# EAGLE board AIO (EAGLE 6.5.0), part 1 of 2
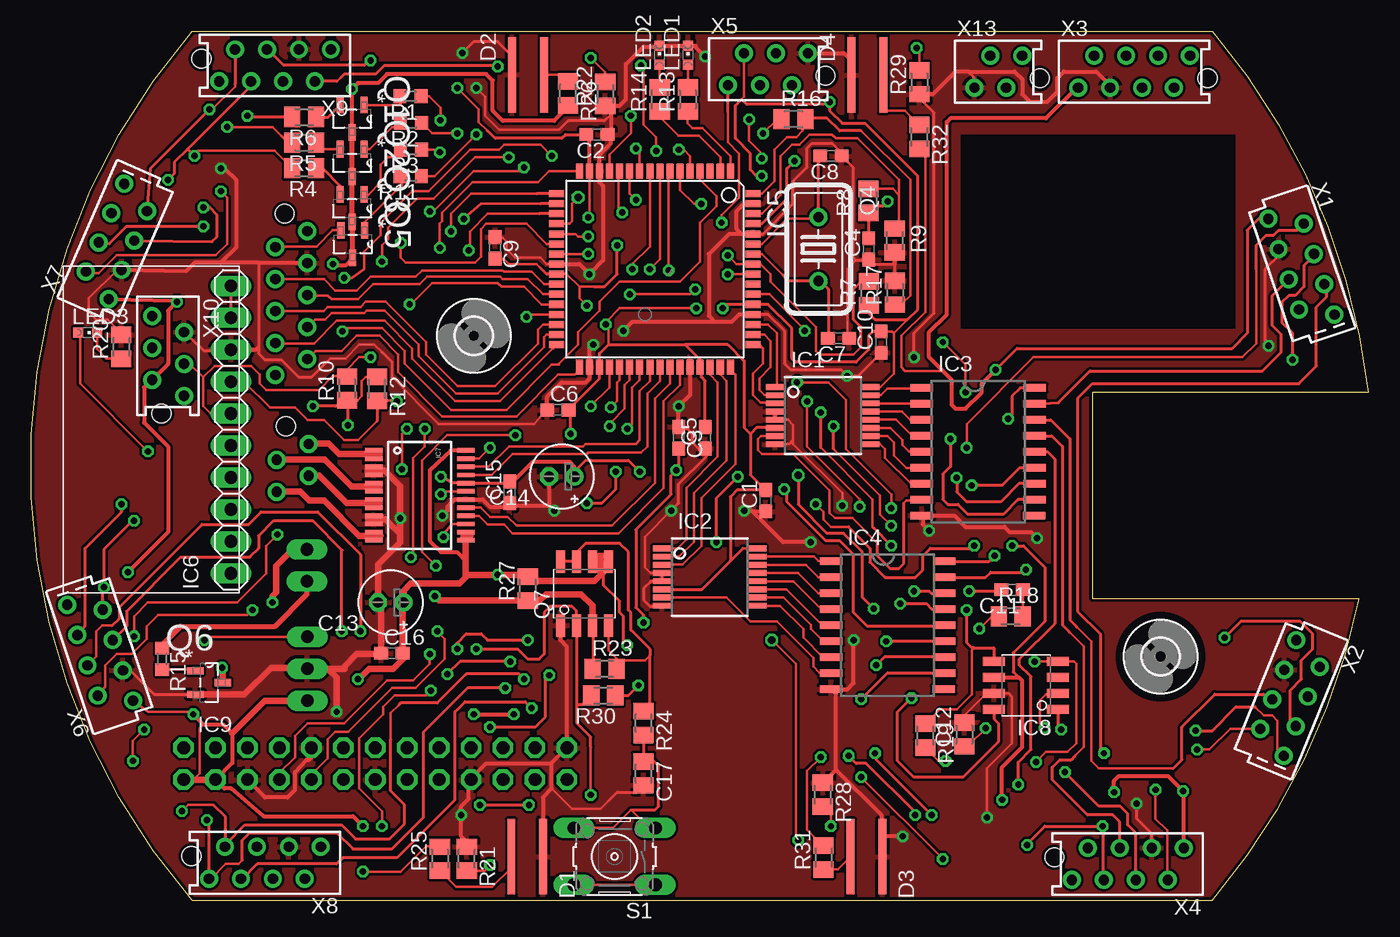
[diagram p2: board, top side]
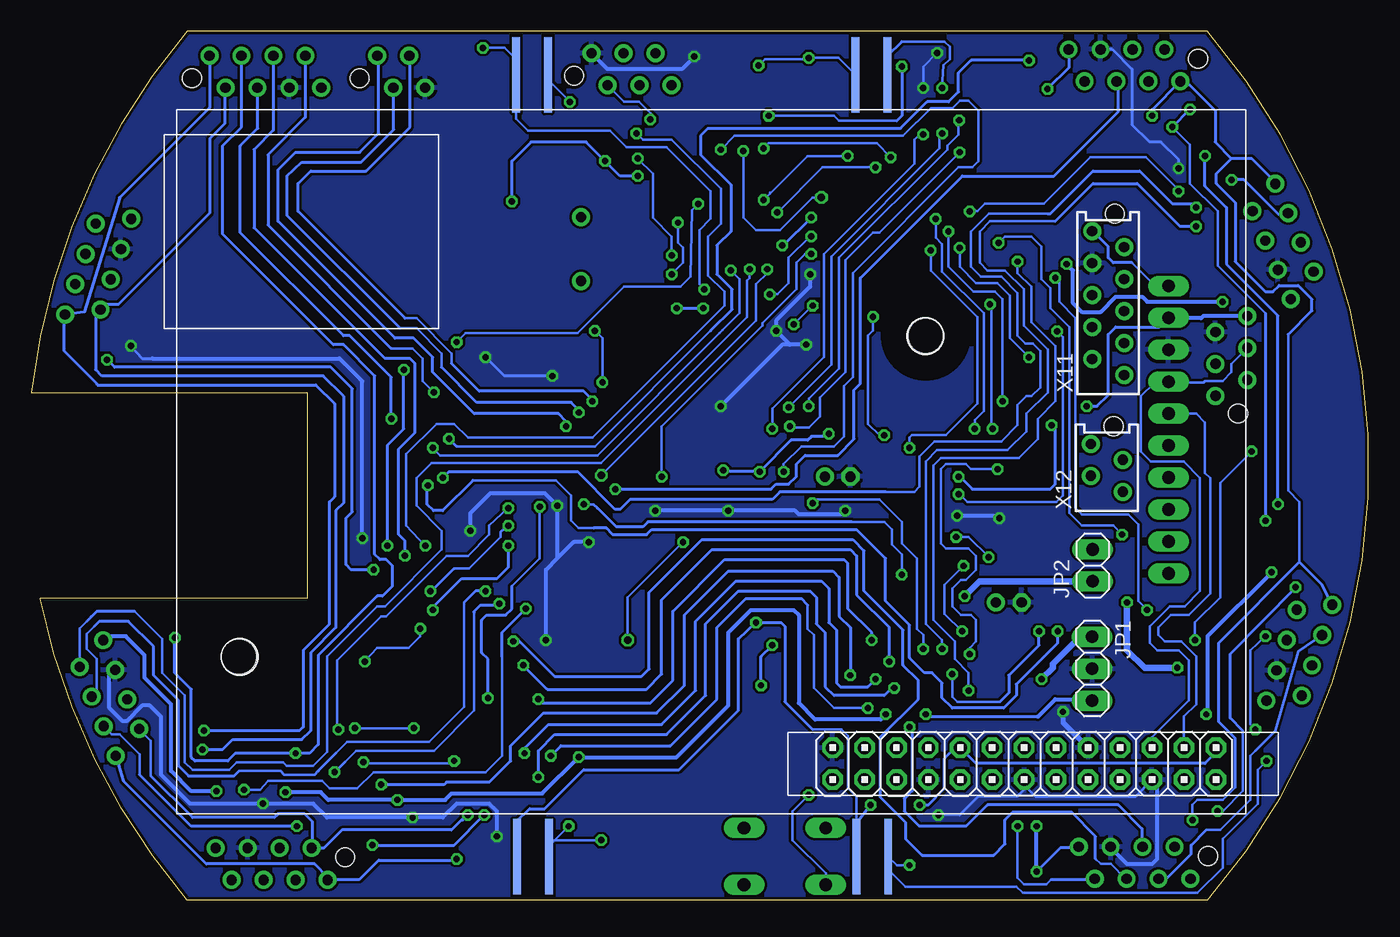
[diagram p3: board, bottom side, seen from below]

Size 106.26 x 69.1 mm. Coordinates in mm from the lower left corner, seen from the top.
Outline: 12.76,0 arc-81 12.76,69.1 93.86,69.1 arc-34 106.26,40.4 84.36,40.4 84.36,24 105.56,24 arc-29 93.86,0 12.76,0
Copper layers (1*16): Top 0.035mm / dielectric 1.5mm / Bottom 0.035mm
Design rules "production": minimum track width 8mil, minimum drill 14mil, track to track 8mil, track to pad 8mil, pad to pad 6mil, via to via 8mil, smd to smd 6mil, copper to edge 10mil, drill to drill 8mil, minimum pad ring 12mil, minimum via ring 8mil, stop-mask expansion 4mil, vias tented up to drill 25mil, thermal gap 10mil

## Footprints (pad centres in the part's own frame; a part is rotated, then mirrored left to right if it is on the bottom)
C0603 = smd 1.1 x 1: 1 -0.85,0; 2 0.85,0
M0805 = smd 1.3 x 1.6: 1 -0.95,0; 2 0.95,0
E2-5 = drill 0.813 pad 1.27: + -1.016,0 | drill 0.813 pad 1.27 octagon: - 1.016,0
CNY70 = smd 6 x 0.635: LED_A -3,1.27; LED_C -3,-1.27 | smd 6 x 0.635 bottom: TRANS_C -3,-1.27; TRANS_E -3,1.27
SSOP16 = smd 0.46 x 1.43: 1 -2.275,-3.795; 2 -1.625,-3.795; 3 -0.975,-3.795; 4 -0.325,-3.795; 5 0.325,-3.795; 6 0.975,-3.795; 7 1.625,-3.795; 8 2.275,-3.795; 9 2.275,3.795; 10 1.625,3.795; 11 0.975,3.795; 12 0.325,3.795; 13 -0.325,3.795; 14 -0.975,3.795; 15 -1.625,3.795; 16 -2.275,3.795
SOP18 = smd 0.6 x 1.8: 1 -5.08,-4.475; 2 -3.81,-4.475; 3 -2.54,-4.475; 4 -1.27,-4.475; 5 0,-4.475; 6 1.27,-4.475; 7 2.54,-4.475; 8 3.81,-4.475; 9 5.08,-4.475; 10 5.08,4.475; 11 3.81,4.5; 12 2.54,4.5; 13 1.27,4.5; 14 0,4.5; 15 -1.27,4.5; 16 -2.54,4.5; 17 -3.81,4.5; 18 -5.08,4.5
TQFP-64A-64 = smd 1.194 x 0.559: 1 -7.8,6; 2 -7.8,5.2; 3 -7.8,4.4; 4 -7.8,3.6; 5 -7.8,2.8; 6 -7.8,2; 7 -7.8,1.2; 8 -7.8,0.4; 9 -7.8,-0.4; 10 -7.8,-1.2; 11 -7.8,-2; 12 -7.8,-2.8; 13 -7.8,-3.6; 14 -7.8,-4.4; 15 -7.8,-5.2; 16 -7.8,-6; 33 7.8,-6; 34 7.8,-5.2; 35 7.8,-4.4; 36 7.8,-3.6; 37 7.8,-2.8; 38 7.8,-2; 39 7.8,-1.2; 40 7.8,-0.4; 41 7.8,0.4; 42 7.8,1.2; 43 7.8,2; 44 7.8,2.8; 45 7.8,3.6; 46 7.8,4.4; 47 7.8,5.2; 48 7.8,6 | smd 0.559 x 1.194: 17 -6,-7.8; 18 -5.2,-7.8; 19 -4.4,-7.8; 20 -3.6,-7.8; 21 -2.8,-7.8; 22 -2,-7.8; 23 -1.2,-7.8; 24 -0.4,-7.8; 25 0.4,-7.8; 26 1.2,-7.8; 27 2,-7.8; 28 2.8,-7.8; 29 3.6,-7.8; 30 4.4,-7.8; 31 5.2,-7.8; 32 6,-7.8; 49 6,7.8; 50 5.2,7.8; 51 4.4,7.8; 52 3.6,7.8; 53 2.8,7.8; 54 2,7.8; 55 1.2,7.8; 56 0.4,7.8; 57 -0.4,7.8; 58 -1.2,7.8; 59 -2,7.8; 60 -2.8,7.8; 61 -3.6,7.8; 62 -4.4,7.8; 63 -5.2,7.8; 64 -6,7.8
GY-81 = drill 1.016 long: 3V3 8.89,-6.35; A_INT1 -3.81,-6.35; G_INT -6.35,-6.35; GND 6.35,-6.35; M_DRDY -1.27,-6.35; P_E0C -11.43,-6.35; P_XCLR -8.89,-6.35; SCL 3.81,-6.35; SDA 1.27,-6.35; VCC_IN 11.43,-6.35
SSOP24 = smd 0.348 x 1.397: 1 -3.575,-3.656; 2 -2.925,-3.656; 3 -2.275,-3.656; 4 -1.625,-3.656; 5 -0.975,-3.656; 6 -0.325,-3.656; 7 0.325,-3.656; 8 0.975,-3.656; 9 1.625,-3.656; 10 2.275,-3.656; 11 2.925,-3.656; 12 3.575,-3.656; 13 3.575,3.656; 14 2.925,3.656; 15 2.275,3.656; 16 1.625,3.656; 17 0.975,3.656; 18 0.325,3.656; 19 -0.325,3.656; 20 -0.975,3.656; 21 -1.625,3.656; 22 -2.275,3.656; 23 -2.925,3.656; 24 -3.575,3.656
SO08 = smd 0.72 x 1.78: 1 -1.905,-2.543; 2 -0.635,-2.543; 3 0.635,-2.543; 4 1.905,-2.543; 5 1.905,2.543; 6 0.635,2.543; 7 -0.635,2.543; 8 -1.905,2.543
RASPERRRY-PI = drill 1.016 octagon: 3V3@1 50.736,82.608; 3V3@2 50.736,62.288; 5V@1 53.276,82.608; 5V@2 53.276,80.068; GND@1 50.736,72.448; GND@2 50.736,52.128; GND@3 53.276,77.528; GND@4 53.276,67.368; GND@5 53.276,59.748; GPIO_0 50.736,80.068; GPIO_1 50.736,77.528; GPIO_4 50.736,74.988; GPIO_7 53.276,52.128; GPIO_8 53.276,54.668; GPIO_9 50.736,57.208; GPIO_10 50.736,59.748; GPIO_11 50.736,54.668; GPIO_14 53.276,74.988; GPIO_15 53.276,72.448; GPIO_17 50.736,69.908; GPIO_18 53.276,69.908; GPIO_21 50.736,67.368; GPIO_22 50.736,64.828; GPIO_23 53.276,64.828; GPIO_24 53.276,62.288; GPIO_25 53.276,57.208
1X03 = drill 1.016 long: 1 -2.54,0; 2 0,0; 3 2.54,0
1X02 = drill 1.016 long: 1 -1.27,0; 2 1.27,0
CHIPLED_0603 = smd 0.8 x 0.8: A 0,-0.75; C 0,0.75
SOT95P240X112-3N = smd 1.321 x 0.559: D 1.092,0; G -1.092,0.94; S -1.092,-0.94
HC18U-V = drill 0.813: 1 -2.54,0; 2 2.54,0
R0603 = smd 1 x 1.1: 1 -0.85,0; 2 0.85,0
B3F-10XX = drill 1.016 long: 1 -3.251,2.261; 2 3.251,2.261; 3 -3.251,-2.261; 4 3.251,-2.261
2,8 = hole 2.8: 0,0
FSIDE-8 = drill 0.813: 1 -4.445,-1.27; 2 -3.175,1.27; 3 -1.905,-1.27; 4 -0.635,1.27; 5 0.635,-1.27; 6 1.905,1.27; 7 3.175,-1.27; 8 4.445,1.27
FTOP-8 = drill 0.813: 1 -4.445,-1.27; 2 -3.175,1.27; 3 -1.905,-1.27; 4 -0.635,1.27; 5 0.635,-1.27; 6 1.905,1.27; 7 3.175,-1.27; 8 4.445,1.27 | hole 1.5: 5.845,-0.53
FTOP-6 = drill 0.813: 1 -3.175,-1.27; 2 -1.905,1.27; 3 -0.635,-1.27; 4 0.635,1.27; 5 1.905,-1.27; 6 3.175,1.27 | hole 1.5: 4.575,-0.53
FTOP-10 = drill 0.813: 1 -5.715,-1.27; 2 -4.445,1.27; 3 -3.175,-1.27; 4 -1.905,1.27; 5 -0.635,-1.27; 6 0.635,1.27; 7 1.905,-1.27; 8 3.175,1.27; 9 4.445,-1.27; 10 5.715,1.27 | hole 1.5: 7.115,-0.53
FTOP-4 = drill 0.813: 1 -1.905,-1.27; 2 -0.635,1.27; 3 0.635,-1.27; 4 1.905,1.27 | hole 1.5: 3.305,-0.53

## Placement (x,y rotation side)
C1  100nF  [C0603]  58.36,31.8 90 top
C2  100nF  [C0603]  44.96,60.9 180 top
C3  100nF  [C0603]  51.46,36.8 270 top
C4  100nF  [C0603]  66.56,51.8 90 top
C5  100nF  [C0603]  53.56,36.8 90 top
C6  100nF  [C0603]  41.86,39 0 top
C7  22pF  [C0603]  64.16,44.7 180 top
C8  22pF  [C0603]  63.56,59.2 180 top
C9  100nF  [C0603]  36.86,51.9 270 top
C10  100nF  [C0603]  67.56,44.4 90 top
C11  100nF  [C0603]  77.96,24.7 180 top
C12  1uF  [M0805]  74.16,13.2 90 top
C13  10uF  [E2-5]  28.56,23.7 180 top
C14  10uF  [E2-5]  42.16,33.7 180 top
C15  100nF  [C0603]  38.02,32.46 90 top
C16  100nF  [C0603]  28.66,19.66 0 top
C17  4,7uF  [M0805]  48.66,10.1 270 top
D1  CNY70  [CNY70]  39.42,6.49 90 top
D2  CNY70  [CNY70]  39.49,62.65 270 top
D3  CNY70  [CNY70]  66.39,6.49 90 top
D4  CNY70  [CNY70]  66.46,62.62 270 top
IC1  74HC238SSOP  [SSOP16]  62.92,38.55 270 top
IC2  74HC238SSOP  [SSOP16]  53.92,25.71 270 top
IC3  ULN2803ASOP18  [SOP18]  75.25,35.68 270 top
IC4  ULN2803ASOP18  [SOP18]  68.05,21.88 270 top
IC5  ATXMEGA64D3-AU  [TQFP-64A-64]  49.56,50.2 270 top
IC6  GY-81  [GY-81]  9.51,37.44 90 top
IC7  TB6612FNG  [SSOP24]  30.87,32.21 270 top
IC8  TS34119SMD  [SO08]  79.06,17.1 90 top
IC9  RASPBERRY-PI  [RASPERRRY-PI]  94.7,62.88 270 bottom
JP1  Step_Down_Conn  [1X03]  21.93,18.43 270 bottom
JP2  batt_conn  [1X02]  21.89,26.65 90 bottom
LED1  YELLOW  [CHIPLED_0603]  52.19,67.21 0 top
LED2  RED  [CHIPLED_0603]  49.92,67.21 0 top
LED3  blue  [CHIPLED_0603]  4.48,45.17 270 top
Q1  DMN2075U  [SOT95P240X112-3N]  25.49,62.16 270 top
Q2  DMN2075U  [SOT95P240X112-3N]  25.49,58.65 270 top
Q3  DMN2075U  [SOT95P240X112-3N]  25.49,55.04 270 top
Q4  32Mhz  [HC18U-V]  62.56,51.8 270 top
Q5  DMN2075U  [SOT95P240X112-3N]  25.54,52.2 270 top
Q6  DMN2075U  [SOT95P240X112-3N]  14.12,17.32 0 top
Q7  DMC3028LSD  [SO08]  43.96,24.4 0 top
R1  100R  [R0603]  30.13,63.94 180 top
R2  100R  [R0603]  30.17,61.82 180 top
R3  100R  [R0603]  30.17,59.71 180 top
R4  [M0805]  21.68,58.22 180 top
R5  [M0805]  21.68,60.26 180 top
R6  [M0805]  21.68,62.3 180 top
R7  10K  [M0805]  66.59,48.28 90 top
R8  [M0805]  66.55,55.63 90 top
R9  [M0805]  68.63,52.47 270 top
R10  10k  [M0805]  25.09,40.71 90 top
R11  100R  [R0603]  30.16,57.6 180 top
R12  10k  [M0805]  27.47,40.69 270 top
R13  220R  [M0805]  52.19,63.69 90 top
R14  390R  [M0805]  49.95,63.69 90 top
R15  100R  [R0603]  10.39,19.21 270 top
R16  [M0805]  60.58,62.12 0 top
R17  [M0805]  68.64,48.33 90 top
R18  3k  [M0805]  77.86,22.6 0 top
R19  75k  [M0805]  71.06,13.1 270 top
R20  1K  [M0805]  7.15,44.02 90 top
R21  [M0805]  34.61,3.32 270 top
R22  [M0805]  45.62,64.14 90 top
R23  10k  [M0805]  45.56,18.4 0 top
R24  100k  [M0805]  48.66,14.1 270 top
R25  [M0805]  32.47,3.32 90 top
R26  [M0805]  42.66,64.16 270 top
R27  0R  [M0805]  39.46,24.8 90 top
R28  [M0805]  62.91,8.42 270 top
R29  [M0805]  70.58,65.06 90 top
R30  10k  [M0805]  45.46,16.3 180 top
R31  [M0805]  62.97,3.42 90 top
R32  [M0805]  70.58,60.72 270 top
S1  On / Off  [B3F-10XX]  46.36,3.5 180 top
U$1  [COPPER7]  77.56,54.8 0 top
U$4  [2,8]  89.76,19.4 0 top
U$6  [2,8]  35.16,44.9 0 top
X1  Sens1  [FSIDE-8]  100.96,50.4 288.7 top
X2  Sens2  [FSIDE-8]  100.06,16.1 247.9 top
X3  Sens0  [FTOP-8]  87.66,65.9 0 top
X4  Sens3  [FTOP-8]  87.16,2.9 180 top
X5  PDI interface (ISP)  [FTOP-6]  58.56,66.1 0 top
X6  Sens5  [FSIDE-8]  5.46,19.7 108.5 top
X7  Sens6  [FSIDE-8]  6.76,52.4 66.5 top
X8  Sens4  [FTOP-8]  18.56,3 180 top
X9  Sens7  [FTOP-8]  19.36,66.4 180 top
X10  exp header  [FTOP-6]  10.86,43.3 270 top
X11  line follow  [FTOP-10]  20.66,47.5 90 bottom
X12  motor  [FTOP-4]  20.76,34.4 90 bottom
X13  audio  [FTOP-4]  76.86,65.9 0 top